# EAGLE design 1. (EAGLE 9.6.2)
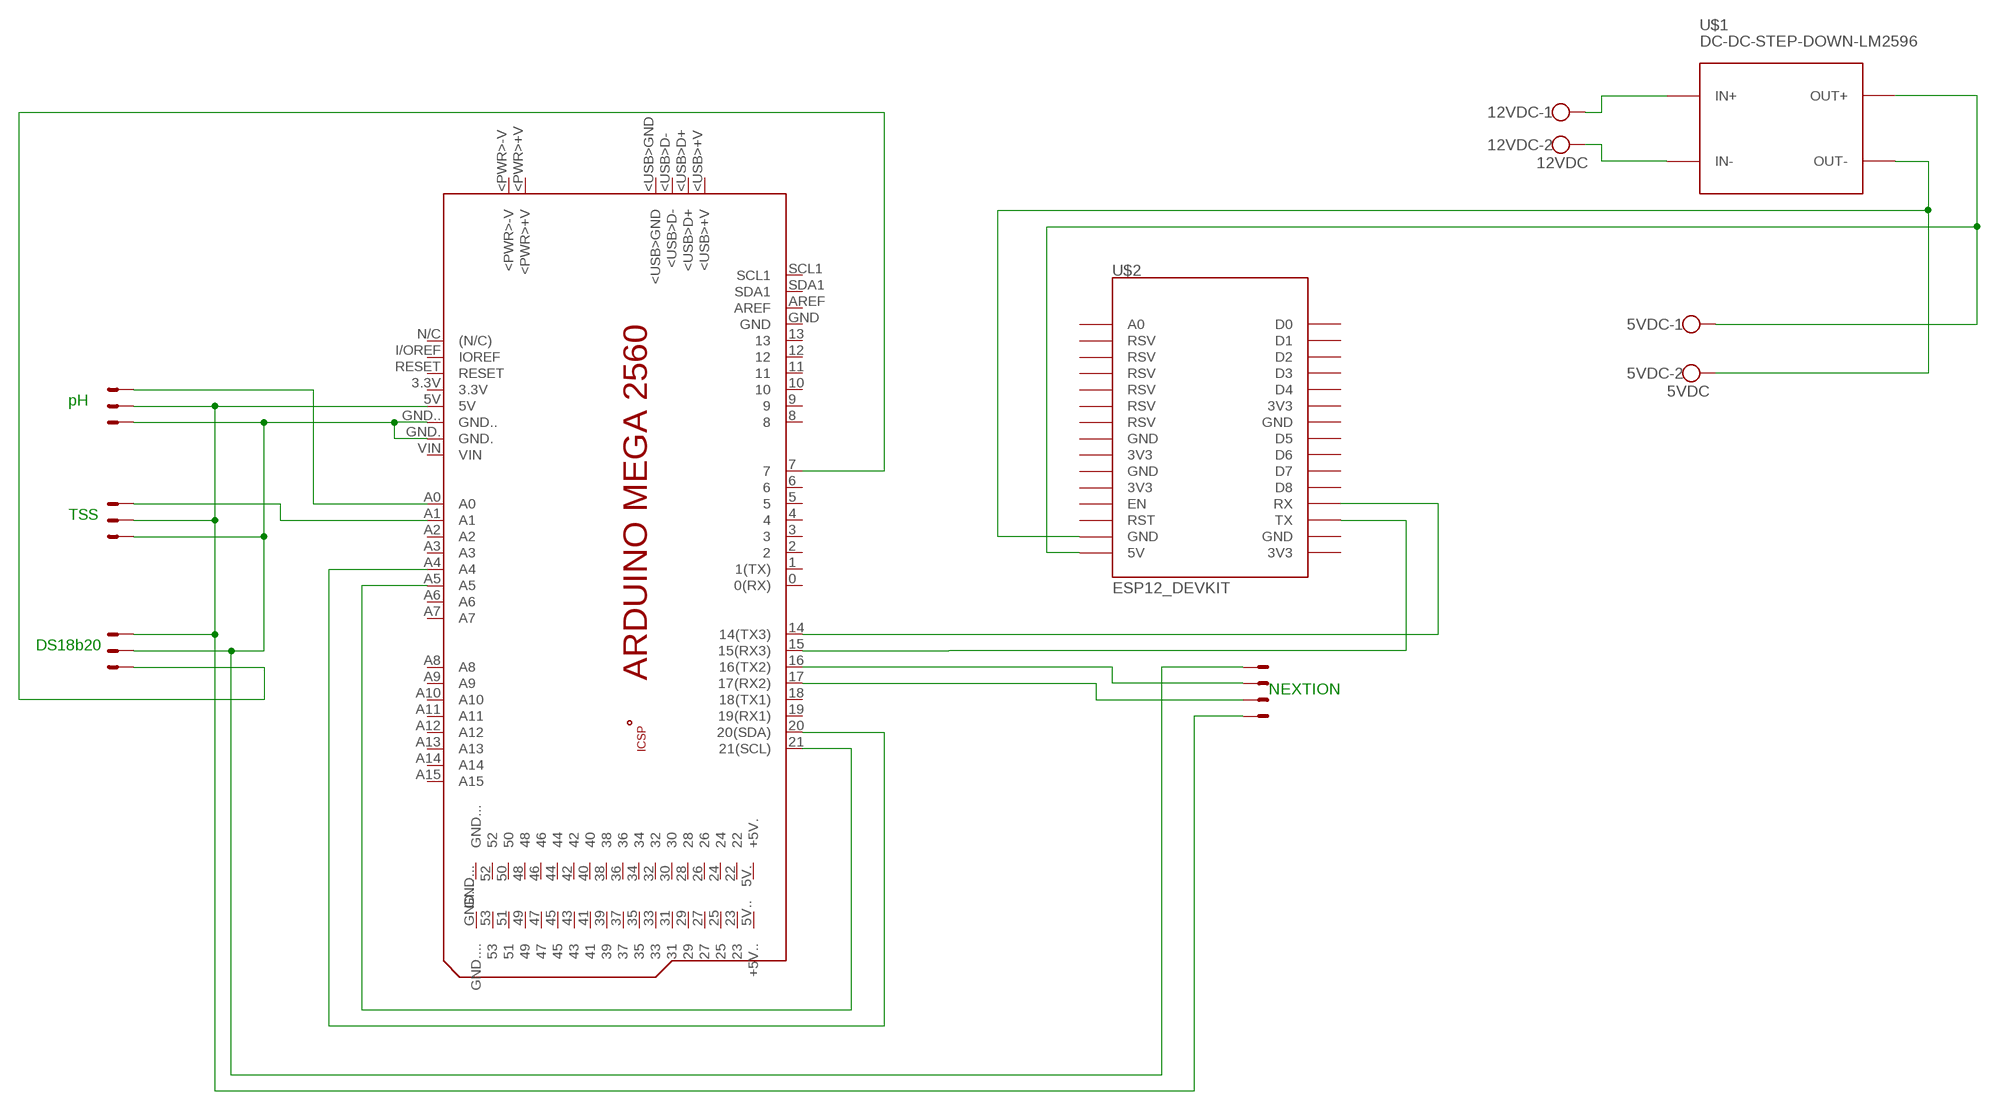
[diagram p0: schematic, sheet 1]

## Parts
5VDC  5VDC  W237-102  [W237-102]
12VDC  12VDC  W237-102  [W237-102]
A0  22-23-2031  [22-23-2031]
PCB1  ARDUINO_MEGA2560  [ARDUINO_MEGA2560]
U$1  DC-DC-STEP-DOWN-LM2596  [DC-DC-STEP-DOWN-LM2596]
U$2  ESP12_DEVKIT  [ESP12_DEVKIT]
X1  22-23-2041  [22-23-2041]
X2  22-23-2031  [22-23-2031]
X3  22-23-2031  [22-23-2031]

## Nets
N$1: 12VDC.1 U$1.IN+
N$2: 12VDC.2 U$1.IN-
N$3: A0.1 PCB1.GND. PCB1.GND.. X1.1 X2.1 X3.2
N$4: A0.2 PCB1.5V X1.4 X2.2 X3.3
N$5: A0.3 PCB1.A0
N$6: PCB1.A1 X2.3
N$7: PCB1.7 X3.1
N$8: PCB1.20(20(SDA)) PCB1.A4
N$9: PCB1.21(21(SCL)) PCB1.A5
N$10: PCB1.14(14(TX3)) U$2.RX
N$11: PCB1.15(15(RX3)) U$2.TX
N$12: 5VDC.1 U$1.OUT+ U$2.5V
N$13: 5VDC.2 U$1.OUT- U$2.GND@1(GND)
N$14: PCB1.16(16(TX2)) X1.2
N$15: PCB1.17(17(RX2)) X1.3
Unconnected: PCB1.0(0(RX)) PCB1.1(1(TX)) PCB1.2 PCB1.3 PCB1.3.3V PCB1.4 PCB1.5 PCB1.5V.(+5V.) PCB1.5V..(+5V..) PCB1.6 PCB1.8 PCB1.9 PCB1.10 PCB1.11 PCB1.12 PCB1.13 PCB1.18(18(TX1)) PCB1.19(19(RX1)) PCB1.22 PCB1.23 PCB1.24 PCB1.25 PCB1.26 PCB1.27 PCB1.28 PCB1.29 PCB1.30 PCB1.31 PCB1.32 PCB1.33 PCB1.34 PCB1.35 PCB1.36 PCB1.37 PCB1.38 PCB1.39 PCB1.40 PCB1.41 PCB1.42 PCB1.43 PCB1.44 PCB1.45 PCB1.46 PCB1.47 PCB1.48 PCB1.49 PCB1.50 PCB1.51 PCB1.52 PCB1.53 PCB1.+5V_ PCB1.<PWR>+V PCB1.<PWR>-V PCB1.<USB>+V PCB1.<USB>D+ PCB1.<USB>D- PCB1.<USB>GND PCB1.A2 PCB1.A3 PCB1.A6 PCB1.A7 PCB1.A8 PCB1.A9 PCB1.A10 PCB1.A11 PCB1.A12 PCB1.A13 PCB1.A14 PCB1.A15 PCB1.AREF PCB1.GND PCB1.GND... PCB1.GND.... PCB1.GND__ PCB1.I/OREF(IOREF) PCB1.MISO PCB1.MOSI PCB1.N/C((N/C)) PCB1.RESET PCB1.RESET. PCB1.SCK PCB1.SCL1 PCB1.SDA1 PCB1.VIN U$2.3V3@0(3V3) U$2.3V3@1(3V3) U$2.3V3@2(3V3) U$2.3V3@3(3V3) U$2.A0 U$2.D0 U$2.D1 U$2.D2 U$2.D3 U$2.D4 U$2.D5 U$2.D6 U$2.D7 U$2.D8 U$2.EN U$2.GND@0(GND) U$2.GND@2(GND) U$2.GND@3(GND) U$2.GND@4(GND) U$2.RST U$2.RSV@0(RSV) U$2.RSV@1(RSV) U$2.RSV@2(RSV) U$2.RSV@3(RSV) U$2.RSV@4(RSV) U$2.RSV@5(RSV)

## Notes on the sheet
- pH
- TSS
- DS18b20
- NEXTION

## Library data of the parts
5VDC 12VDC = con-wago-500:W237-102: WAGO SCREW CLAMP; MPN: 237-102; OC_FARNELL: unknown; OC_NEWARK: 70K9898
A0 X2 X3 = con-molex:22-23-2031: .100" (2.54mm) Center Header - 3 Pin; MF: MOLEX; MPN: 22-23-2031; OC_FARNELL: 1462950; OC_NEWARK: 30C0862
PCB1 = E14_Arduino_revC:ARDUINO_MEGA2560: Device for representing an Arduino Mega 2560 board with a footprint in an EAGLE design. Created by Dave Young for Element14. More EAGLE documentation at: http://www.element14.com/community/community/knode/cadsoft_eagle
U$1 = diy-modules:DC-DC-STEP-DOWN-LM2596: DC/DC Step-Down Regulator based on LM2596-ADJ chip LM2596 datasheet available here: http://www.ti.com/lit/ds/symlink/lm2596.pdf Click here to find device on ebay.com <http://www.ebay.com/sch/lm2596+power+regulator>
U$2 = ESP12_DEVKIT:ESP12_DEVKIT: ESP12 DEVKIT BOARD
X1 = con-molex:22-23-2041: .100" (2.54mm) Center Header - 4 Pin; MF: MOLEX; MPN: 22-23-2041; OC_FARNELL: 1462920; OC_NEWARK: 38C0355

## Board
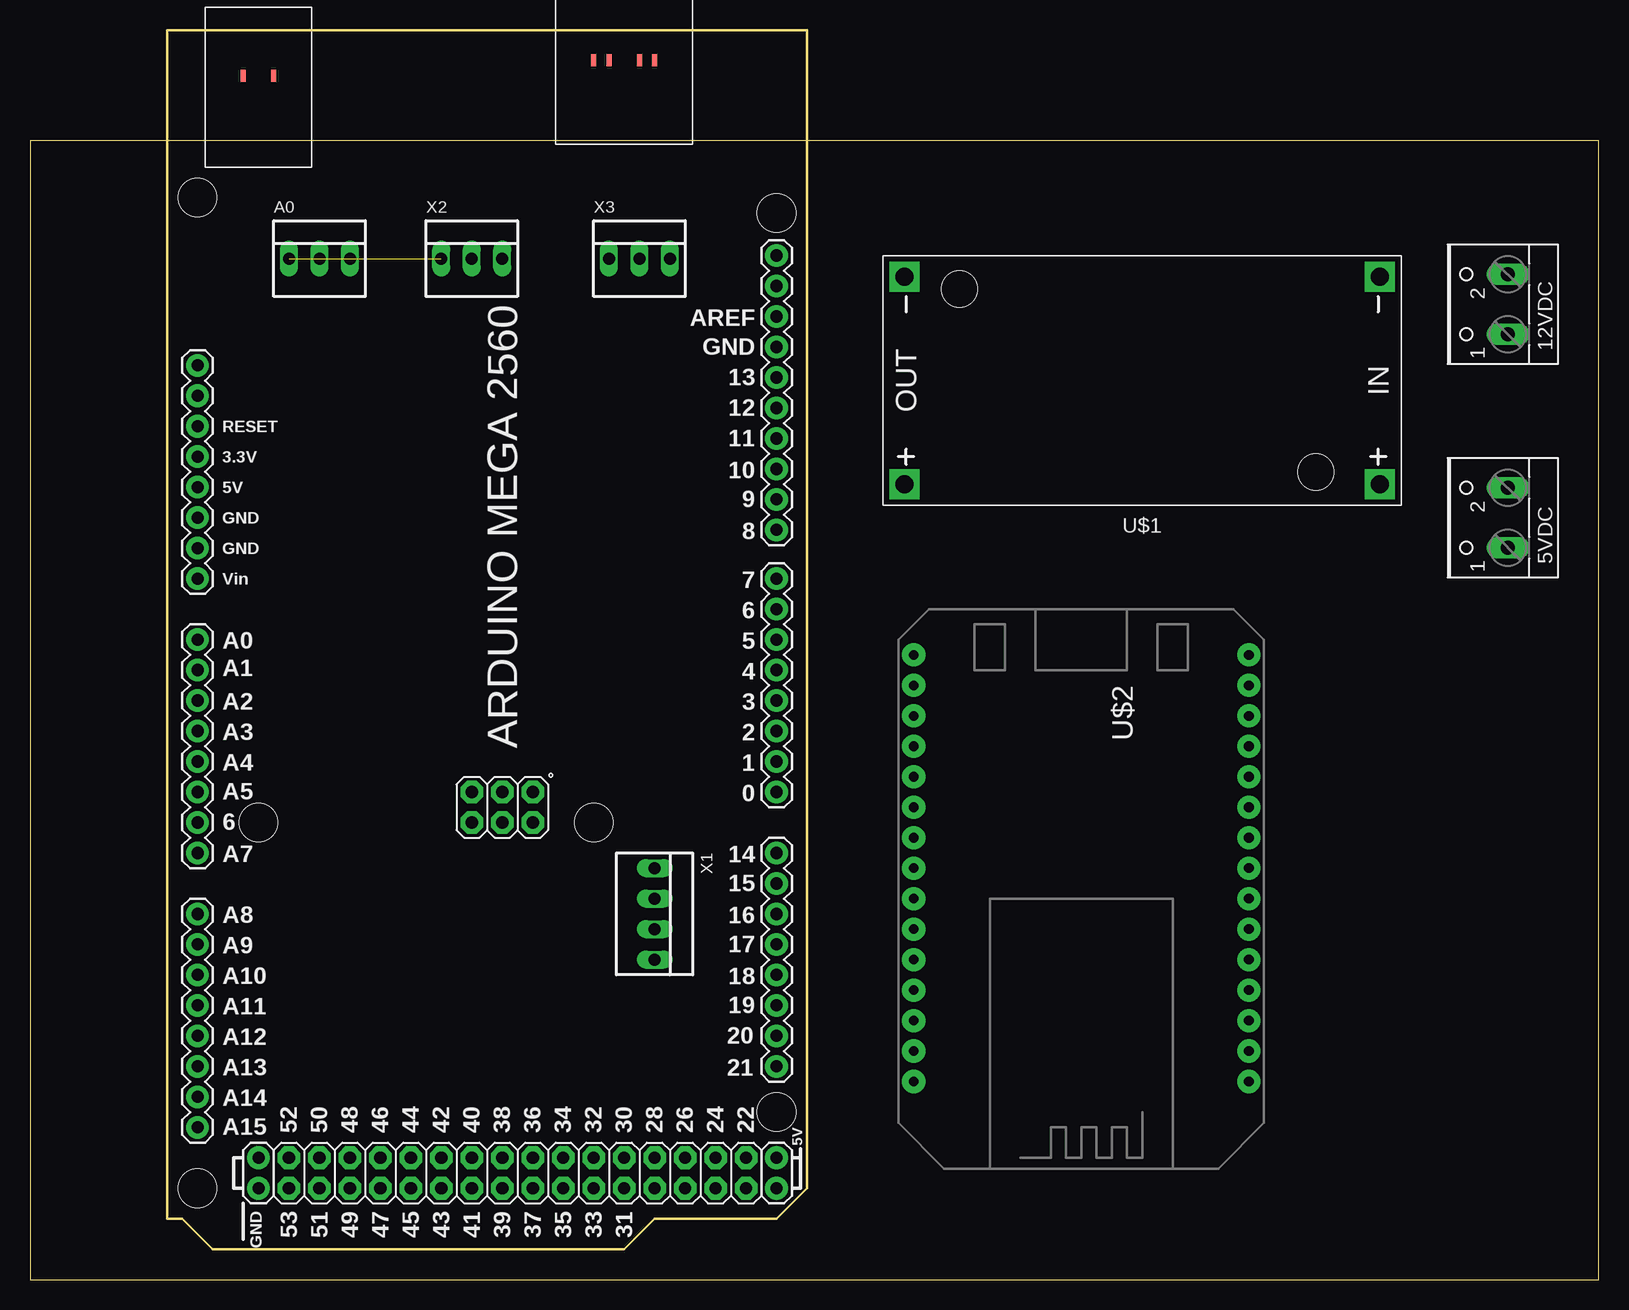
[diagram p1: board, top side]
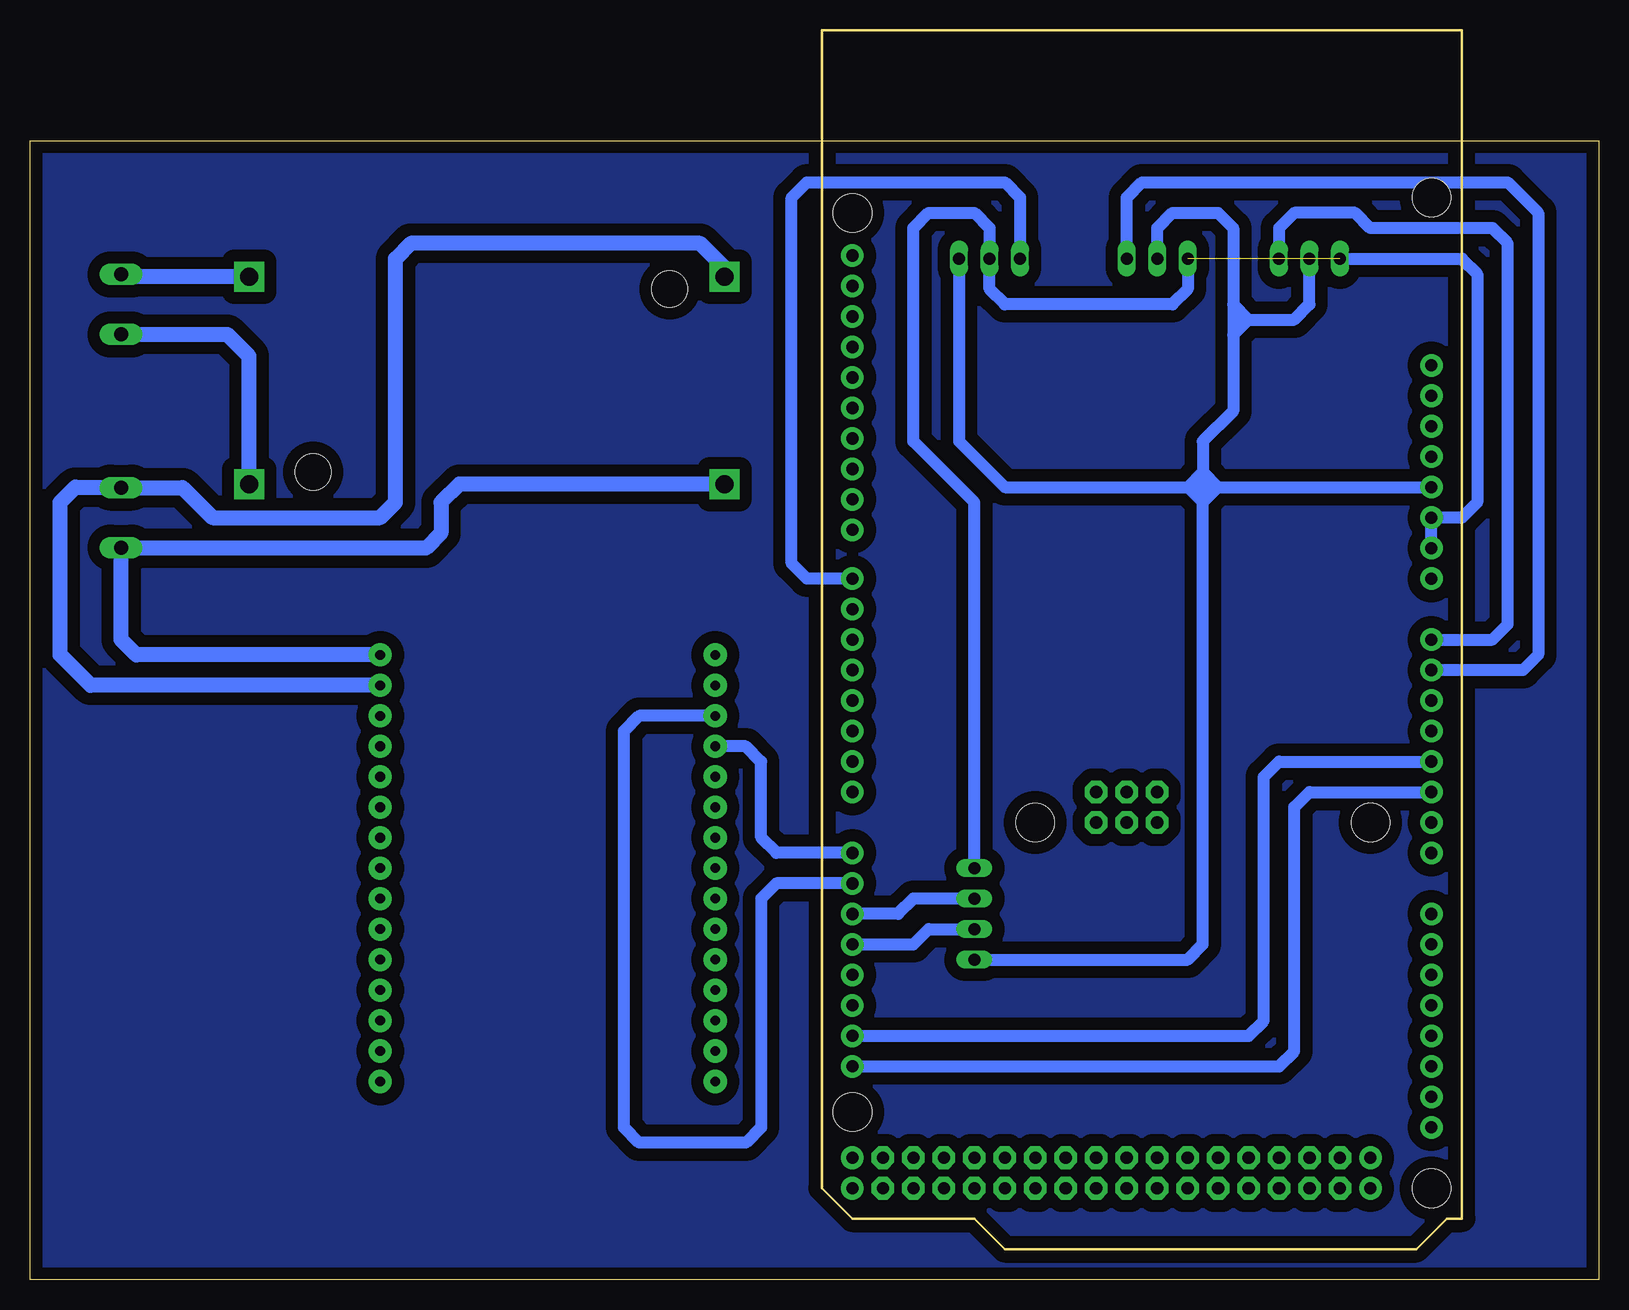
[diagram p2: board, bottom side, seen from below]

Size 130.79 x 94.92 mm. Coordinates in mm from the lower left corner, seen from the top.
Outline: 0,0 130.79,0 130.79,94.92 0,94.92 0,0
Copper layers (1*16): Top 0.035mm / dielectric 1.5mm / Bottom 0.035mm
Design rules "default *": minimum track width 6mil, minimum drill 0.35mm, track to track 40mil, track to pad 40mil, pad to pad 40mil, via to via 40mil, smd to smd 40mil, copper to edge 40mil, drill to drill 6mil, minimum pad ring 10mil, minimum via ring 8mil, stop-mask expansion 4mil, vias tented up to drill 0mil, thermal gap 10mil

### Footprints (pad centres in the part's own frame; a part is rotated, then mirrored left to right if it is on the bottom)
W237-102 = drill 1.194 long: 1 -2.5,-1.27; 2 2.5,-1.27
22-23-2031 = drill 1 long: 1 -2.54,0; 2 0,0; 3 2.54,0
ARDUINO_MEGA2560 = drill 1.016 pad 1.88: 0 63.5,50.8; 1 60.96,50.8; 2 58.42,50.8; 3 55.88,50.8; 3.3V 35.56,2.54; 4 53.34,50.8; 5 50.8,50.8; 5V 38.1,2.54; 5V. 93.98,50.8; 5V.. 96.52,50.8; 6 48.26,50.8; 7 45.72,50.8; 8 41.656,50.8; 9 39.116,50.8; 10 36.576,50.8; 11 34.036,50.8; 12 31.496,50.8; 13 28.956,50.8; 14 68.58,50.8; 15 71.12,50.8; 16 73.66,50.8; 17 76.2,50.8; 18 78.74,50.8; 19 81.28,50.8; 20 83.82,50.8; 21 86.36,50.8; A0 50.8,2.54; A1 53.34,2.54; A2 55.88,2.54; A3 58.42,2.54; A4 60.96,2.54; A5 63.5,2.54; A6 66.04,2.54; A7 68.58,2.54; A8 73.66,2.54; A9 76.2,2.54; A10 78.74,2.54; A11 81.28,2.54; A12 83.82,2.54; A13 86.36,2.54; A14 88.9,2.54; A15 91.44,2.54; AREF 23.876,50.8; GND 26.416,50.8; GND. 43.18,2.54; GND.. 40.64,2.54; GND... 93.98,7.62; GND.... 96.52,7.62; I/OREF 30.48,2.54; N/C 27.94,2.54; RESET 33.02,2.54; SCL1 18.796,50.8; SDA1 21.336,50.8; VIN 45.72,2.54 | drill 1.016 pad 1.88 octagon: 22 93.98,48.26; 23 96.52,48.26; 24 93.98,45.72; 25 96.52,45.72; 26 93.98,43.18; 27 96.52,43.18; 28 93.98,40.64; 29 96.52,40.64; 30 93.98,38.1; 31 96.52,38.1; 32 93.98,35.56; 33 96.52,35.56; 34 93.98,33.02; 35 96.52,33.02; 36 93.98,30.48; 37 96.52,30.48; 38 93.98,27.94; 39 96.52,27.94; 40 93.98,25.4; 41 96.52,25.4; 42 93.98,22.86; 43 96.52,22.86; 44 93.98,20.32; 45 96.52,20.32; 46 93.98,17.78; 47 96.52,17.78; 48 93.98,15.24; 49 96.52,15.24; 50 93.98,12.7; 51 96.52,12.7; 52 93.98,10.16; 53 96.52,10.16; +5V_ 66.04,30.48; GND__ 66.04,25.4; MISO 63.5,30.48; MOSI 66.04,27.94; RESET. 63.5,25.4; SCK 63.5,27.94 | smd 1.016 x 0.508: <PWR>+V 3.81,8.89; <PWR>-V 3.81,6.35; <USB>+V 2.54,40.64; <USB>D+ 2.54,39.37; <USB>D- 2.54,36.83; <USB>GND 2.54,35.56 | hole 3.2: 15.24,50.8; 13.97,2.54; 66.04,35.56; 66.04,7.62; 90.17,50.8; 96.52,2.54
DC-DC-STEP-DOWN-LM2596 = drill 1.5 pad 2.5 square: IN+ -19.812,8.636; IN- -19.812,-8.636; OUT+ 19.812,8.636; OUT- 19.812,-8.636 | hole 3: -14.478,7.62; 15.24,-7.62
ESP12_DEVKIT = drill 0.8 pad 1.93: 3V3@0 -13.97,-7.62; 3V3@1 13.97,5.08; 3V3@2 13.97,-17.78; 3V3@3 -13.97,-2.54; 5V -13.97,-17.78; A0 -13.97,17.78; D0 13.97,17.78; D1 13.97,15.24; D2 13.97,12.7; D3 13.97,10.16; D4 13.97,7.62; D5 13.97,0; D6 13.97,-2.54; D7 13.97,-5.08; D8 13.97,-7.62; EN -13.97,-10.16; GND@0 -13.97,-5.08; GND@1 -13.97,-15.24; GND@2 13.97,2.54; GND@3 13.97,-15.24; GND@4 -13.97,0; RST -13.97,-12.7; RSV@0 -13.97,15.24; RSV@1 -13.97,12.7; RSV@2 -13.97,10.16; RSV@3 -13.97,7.62; RSV@4 -13.97,5.08; RSV@5 -13.97,2.54; RX 13.97,-10.16; TX 13.97,-12.7
22-23-2041 = drill 1 long: 1 -3.81,0; 2 -1.27,0; 3 1.27,0; 4 3.81,0

### Placement (x,y rotation side)
5VDC  121.92,63.5 90 top
12VDC  121.92,81.28 90 top
A0  24.13,85.09 0 top
PCB1  11.43,104.14 270 top
U$1  92.71,74.93 180 top
U$2  87.63,34.29 180 top
X1  52.07,30.48 270 top
X2  36.83,85.09 0 top
X3  50.8,85.09 0 top

### Tracks (layer width: path | path; a pad name or v marks a point on that pad's centre or on a via)
N$1
  Bottom 1.27: U$1.IN+ 112.52,76.96 114.34,78.78 12VDC.1
N$2
  Bottom 1.27: U$1.IN- 122.98,83.57 12VDC.2
N$3  (1 unrouted)
  Bottom 1.016: PCB1.GND. PCB1.GND.. 11.43,63.5 10.16,64.77 10.16,83.82 11.43,85.09 A0.1 | X1.1 52.07,64.77 57.15,69.85 57.15,87.63 55.88,88.9 52.07,88.9 50.8,87.63 X3.2 50.8,82.55 49.53,81.28 35.56,81.28 34.29,82.55 X2.1
N$4
  Bottom 1.016: X3.3 53.34,69.85 49.53,66.04 34.29,66.04 | 34.29,66.04 33.02,66.04 | 33.02,66.04 31.75,66.04 | 31.75,66.04 PCB1.5V | X1.4 34.29,26.67 33.02,27.94 33.02,64.77 | 33.02,64.77 33.02,66.04 | 33.02,64.77 31.75,66.04 | 33.02,64.77 34.29,66.04 | X2.2 36.83,87.63 35.56,88.9 31.75,88.9 30.48,87.63 30.48,81.28 | 29.21,80.01 25.4,80.01 24.13,81.28 A0.2 | 29.21,80.01 30.48,81.28 | 30.48,81.28 30.48,78.74 | 30.48,78.74 30.48,72.39 33.02,69.85 33.02,67.31 | 33.02,67.31 33.02,66.04 | 31.75,66.04 33.02,67.31 | 33.02,67.31 34.29,66.04 | 30.48,78.74 29.21,80.01
N$5
  Bottom 1.016: PCB1.A0 8.89,53.34 7.62,54.61 7.62,86.36 8.89,87.63 19.05,87.63 20.32,88.9 25.4,88.9 26.67,87.63 A0.3
N$6
  Bottom 1.016: X2.3 39.37,90.17 38.1,91.44 7.62,91.44 5.08,88.9 5.08,52.07 6.35,50.8 PCB1.A1
N$7
  Bottom 1.016: PCB1.7 66.04,58.42 67.31,59.69 67.31,90.17 66.04,91.44 49.53,91.44 48.26,90.17 X3.1
N$8
  Bottom 1.016: PCB1.20 29.21,20.32 27.94,21.59 27.94,41.91 26.67,43.18 PCB1.A4
N$9
  Bottom 1.016: PCB1.21 26.67,17.78 25.4,19.05 25.4,39.37 24.13,40.64 PCB1.A5
N$10
  Bottom 1.016: PCB1.14 68.58,35.56 69.85,36.83 69.85,43.18 71.12,44.45 U$2.RX
N$11
  Bottom 1.016: PCB1.15 68.58,33.02 69.85,31.75 69.85,12.7 71.12,11.43 80.01,11.43 81.28,12.7 81.28,45.72 80.01,46.99 U$2.TX
N$12
  Bottom 1.27: U$1.OUT+ 95,66.29 96.52,64.77 96.52,62.23 97.79,60.96 123.15,60.96 5VDC.1 123.19,53.34 121.92,52.07 U$2.5V
N$13
  Bottom 1.27: U$1.OUT- 72.9,84.33 74.93,86.36 99.06,86.36 100.33,85.09 100.33,64.77 101.6,63.5 115.57,63.5 118.07,66 5VDC.2 123.23,66.04 127,66.04 128.27,64.77 128.27,52.07 125.73,49.53 U$2.GND@1
N$14
  Bottom 1.016: X1.2 57.15,31.75 58.42,30.48 PCB1.16
N$15
  Bottom 1.016: X1.3 55.88,29.21 57.15,27.94 PCB1.17
N$16
  pour Bottom: 0,95.25 130.81,95.25 130.81,0 0,0 0,5.08